# EAGLE design single_varactor (EAGLE 9.3.0)
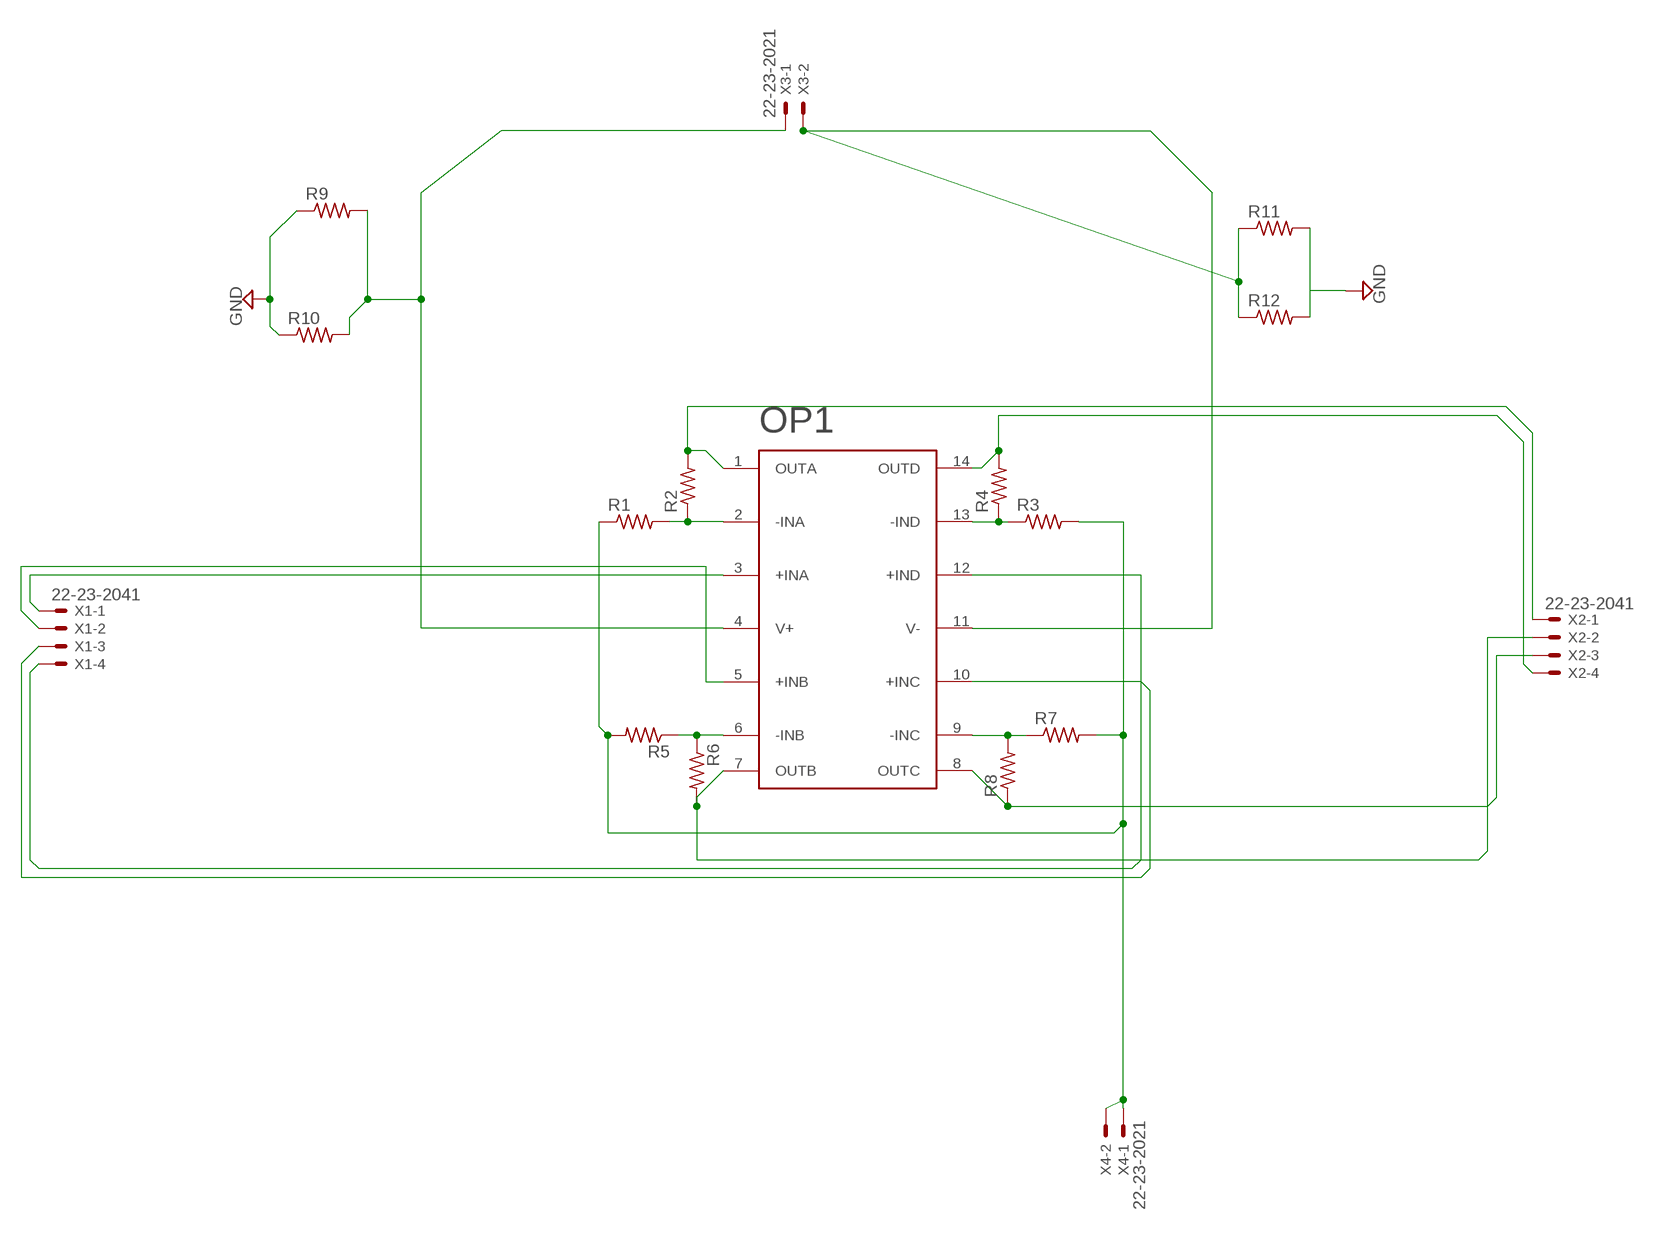
[diagram p0: schematic, sheet 1]

## Parts
OP1  OPAX4172  [OPAX172]
R1  R-US_0204/2V  [0204V]
R2  R-US_0204/2V  [0204V]
R3  R-US_0204/2V  [0204V]
R4  R-US_0204/2V  [0204V]
R5  R-US_0204/2V  [0204V]
R6  R-US_0204/2V  [0204V]
R7  R-US_0204/2V  [0204V]
R8  R-US_0204/2V  [0204V]
R9  R-US_0204/2V  [0204V]
R10  R-US_0204/2V  [0204V]
R11  R-US_0204/2V  [0204V]
R12  R-US_0204/2V  [0204V]
X1  22-23-2041  [22-23-2041]
X2  22-23-2041  [22-23-2041]
X3  22-23-2021  [22-23-2021]
X4  22-23-2021  [22-23-2021]

## Nets
GND: R9.1 R10.1
N$1: OP1.2(-INA) R1.2 R2.1
N$2: OP1.13(-IND) R3.1 R4.1
N$3: OP1.6(-INB) R5.1 R6.1
N$4: OP1.9(-INC) R7.1 R8.2
N$5: OP1.14(OUTD) R4.2 X2.4
N$6: OP1.1(OUTA) R2.2 X2.1
N$7: OP1.7(OUTB) R6.2 X2.2
N$8: OP1.8(OUTC) R8.1 X2.3
N$9: OP1.4(V+) R9.2 R10.2 X3.1
N$11: OP1.3(+INA) X1.1
N$12: OP1.5(+INB) X1.2
N$13: OP1.10(+INC) X1.3
N$14: OP1.12(+IND) X1.4
N$15: R11.2 R12.2
N$16: R1.1 R3.2 R5.2 R7.2 X4.1 X4.2
N$17: OP1.11(V-) R11.1 R12.1 X3.2

## Library data of the parts
OP1 = OPA4172IDR:OPAX4172: Created by Caleb Carr for the Advanced Radar Research Center, Norman, OK This is a replication of the TI OPAx4172 operational amplifier (+4.5-+36v)
R1-R12 = rcl:R-US_: RESISTOR, American symbol; SPICEPREFIX: R
X1 X2 = con-molex:22-23-2041: .100" (2.54mm) Center Header - 4 Pin; MF: MOLEX; MPN: 22-23-2041; OC_FARNELL: 1462920; OC_NEWARK: 38C0355
X3 X4 = con-molex:22-23-2021: .100" (2.54mm) Center Header - 2 Pin; MF: MOLEX; MPN: 22-23-2021; OC_FARNELL: 1462926; OC_NEWARK: 25C3832

## Board
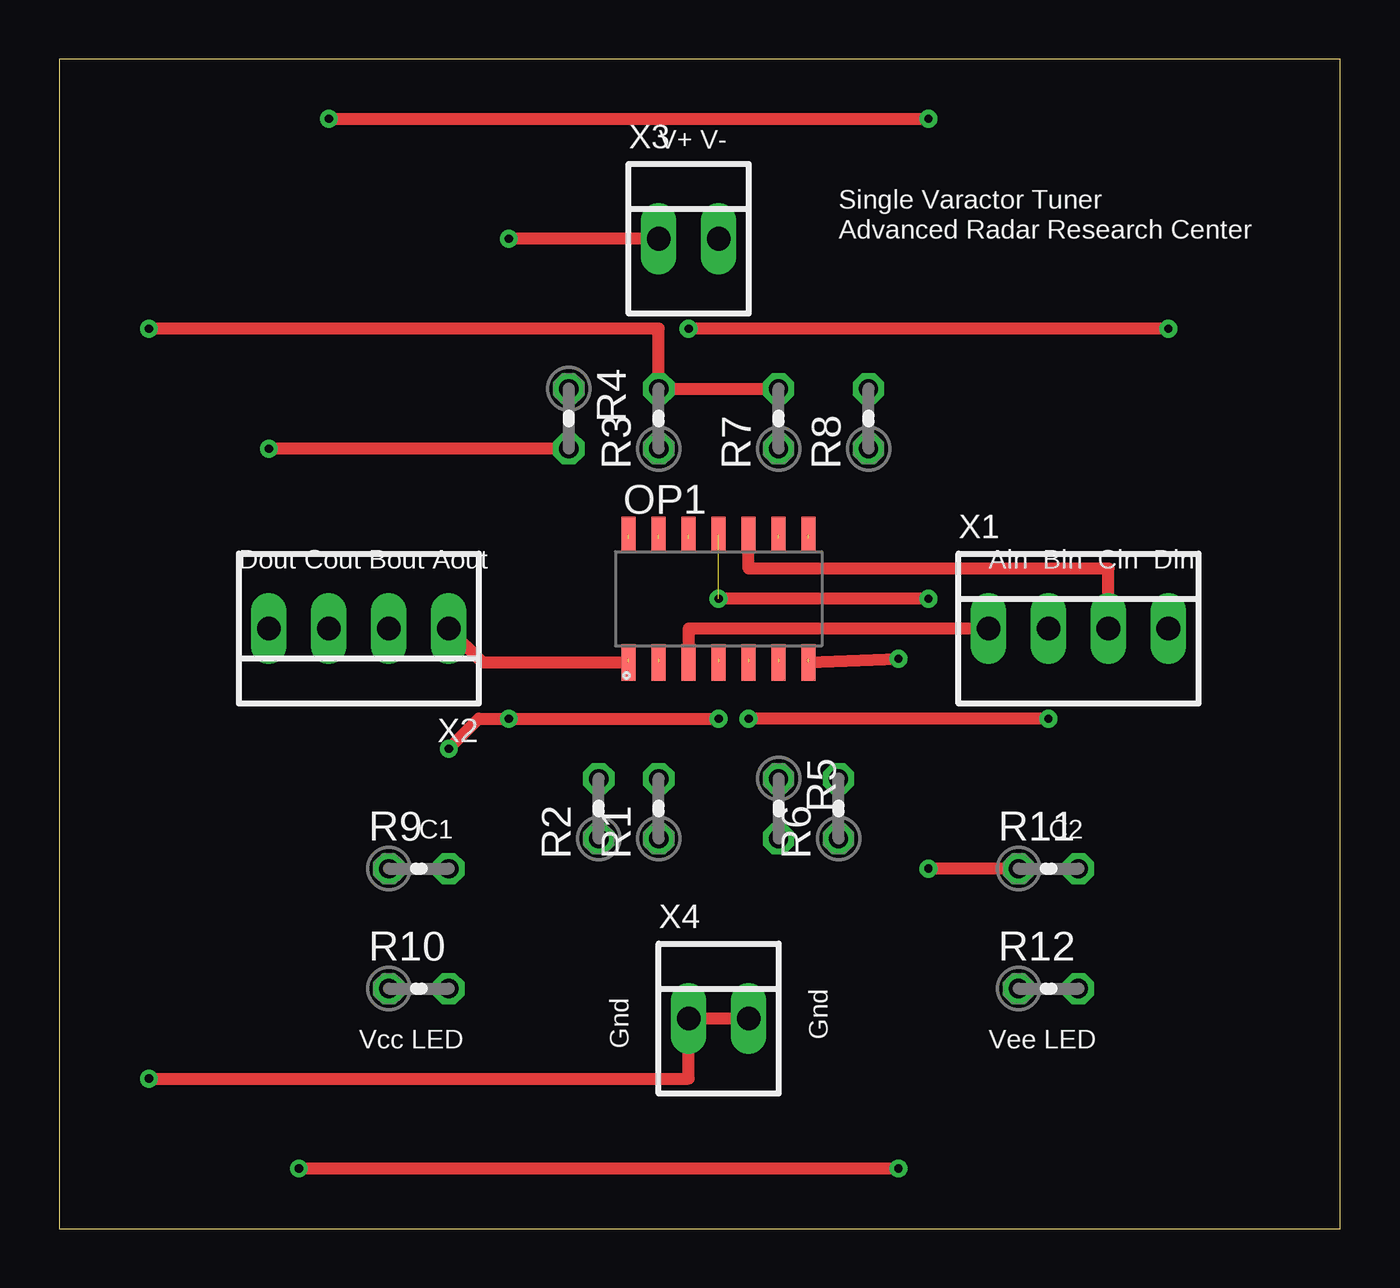
[diagram p1: board, top side]
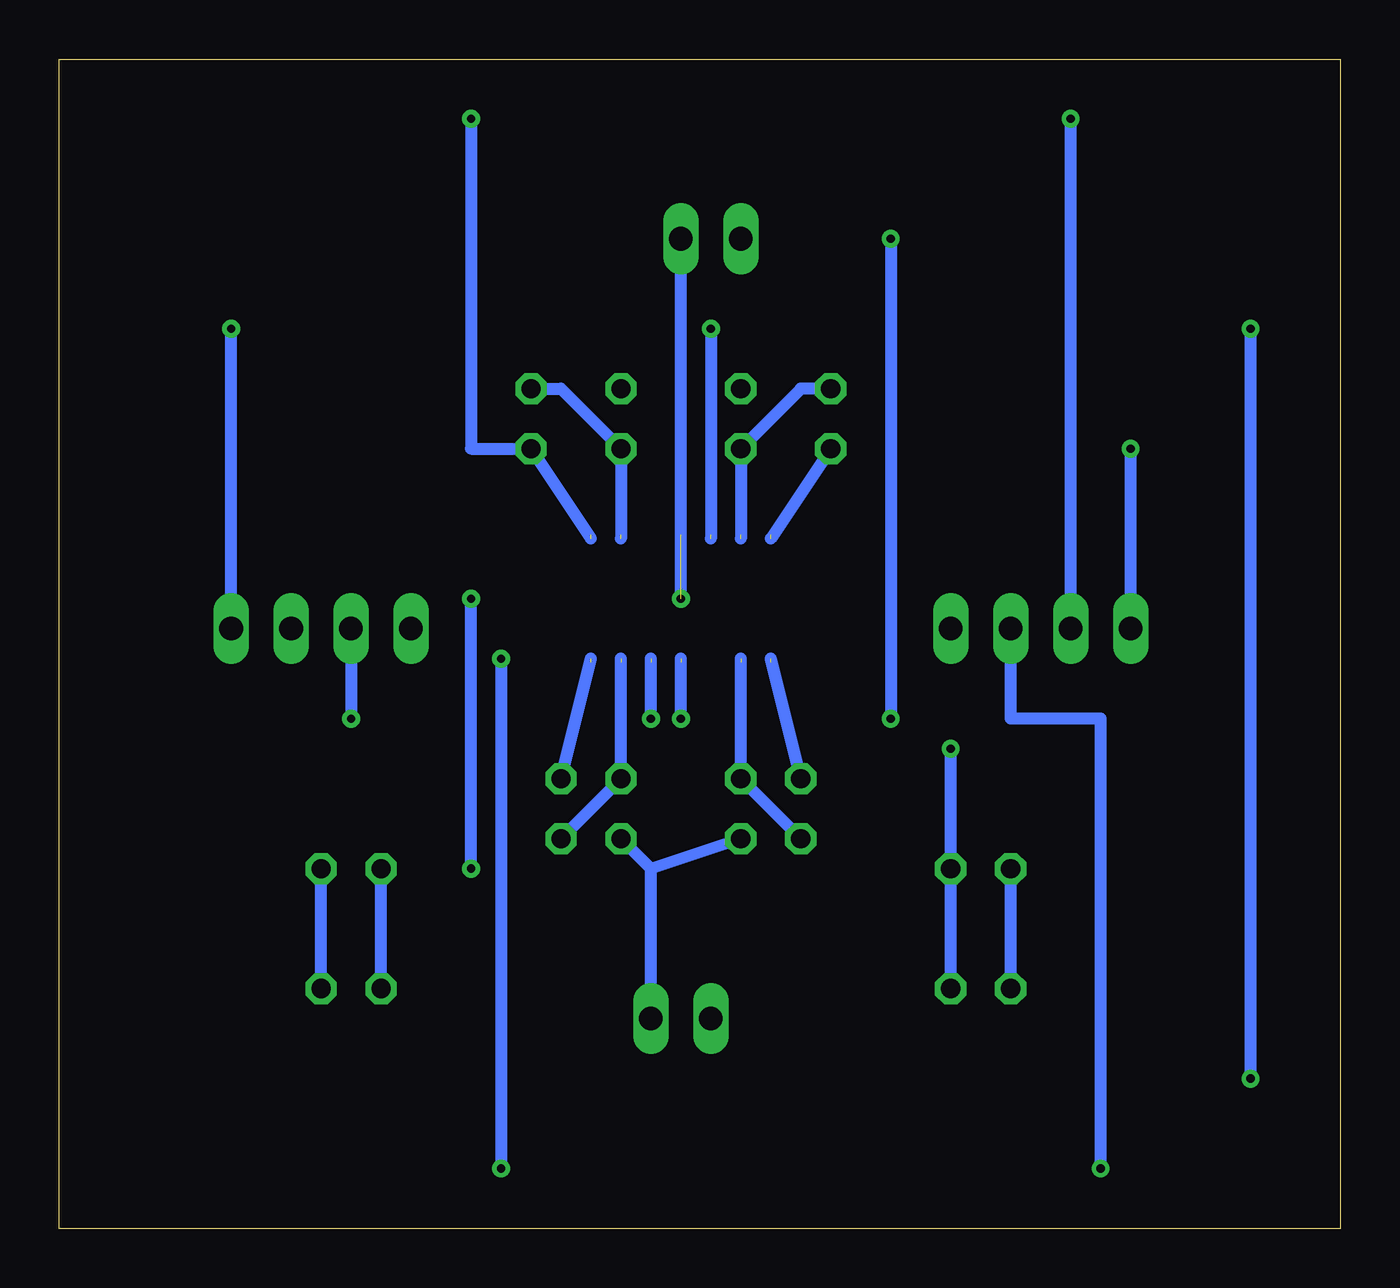
[diagram p2: board, bottom side, seen from below]

Size 54.28 x 49.52 mm. Coordinates in mm from the lower left corner, seen from the top.
Outline: 0,0 54.28,0 54.28,49.52 0,49.52 0,0
Copper layers (1*16): Top 0.035mm / dielectric 1.5mm / Bottom 0.035mm
Design rules "default": minimum track width 6mil, minimum drill 0.35mm, track to track 6mil, track to pad 6mil, pad to pad 6mil, via to via 6mil, smd to smd 6mil, copper to edge 40mil, drill to drill 6mil, minimum pad ring 10mil, minimum via ring 8mil, stop-mask expansion 4mil, vias tented up to drill 0mil, thermal gap 10mil

### Footprints (pad centres in the part's own frame; a part is rotated, then mirrored left to right if it is on the bottom)
OPAX172 = smd 0.6 x 1.55: 1 -3.81,-2.7; 2 -2.54,-2.7; 3 -1.27,-2.7; 4 0,-2.7; 5 1.27,-2.7; 6 2.54,-2.7; 7 3.81,-2.7; 8 3.81,2.7; 9 2.54,2.7; 10 1.27,2.7; 11 0,2.7; 12 -1.27,2.7; 13 -2.54,2.7; 14 -3.81,2.7
0204V = drill 0.813 octagon: 1 -1.27,0; 2 1.27,0
22-23-2041 = drill 1 long: 1 -3.81,0; 2 -1.27,0; 3 1.27,0; 4 3.81,0
22-23-2021 = drill 1 long: 1 -1.27,0; 2 1.27,0

### Placement (x,y rotation side)
OP1  27.94,26.67 0 top
R1  25.4,17.78 90 top
R2  22.86,17.78 90 top
R3  25.4,34.29 90 top
R4  21.59,34.29 270 top
R5  30.48,17.78 270 top
R6  33.02,17.78 90 top
R7  30.48,34.29 90 top
R8  34.29,34.29 90 top
R9  15.24,15.24 0 top
R10  15.24,10.16 0 top
R11  41.91,15.24 0 top
R12  41.91,10.16 0 top
X1  43.18,25.4 0 top
X2  12.7,25.4 180 top
X3  26.67,41.91 0 top
X4  27.94,8.89 0 top

### Tracks (layer width: path | path; a pad name or v marks a point on that pad's centre or on a via)
GND
  Bottom 0.508: R10.1 R9.1
N$1  (1 unrouted)
  Bottom 0.508: R2.1 R1.2 25.4,24.13
N$2  (1 unrouted)
  Bottom 0.508: 25.4,29.21 R3.1 22.86,35.56 R4.1
N$3  (1 unrouted)
  Bottom 0.508: 30.48,24.13 R5.1 R6.1
N$4  (1 unrouted)
  Top 0.152: R8.2 34.29,34.82
  Bottom 0.508: R8.2 33.02,35.56 R7.1 30.48,29.21
N$5  (via drill 0.35)  (1 unrouted)
  Top 0.508: R4.2 v8.89,33.02
  Bottom 0.508: X2.4 v8.89,33.02 | R4.2 24.13,29.21
N$6  (1 unrouted)
  Top 0.508: X2.1 17.94,23.97 OP1.1
  Bottom 0.508: R2.2 24.13,24.13
N$7  (via drill 0.35)  (1 unrouted)
  Top 0.508: OP1.7 v35.56,24.13 | v35.56,2.54 v10.16,2.54
  Bottom 0.508: R6.2 31.75,24.13 | v35.56,24.13 v35.56,2.54 | v10.16,2.54 10.16,21.59 13.97,21.59 X2.2
N$8  (via drill 0.35)  (1 unrouted)
  Top 0.508: v11.43,46.99 v36.83,46.99
  Bottom 0.508: 31.75,29.21 R8.1 36.83,33.02 v36.83,46.99 | X2.3 v11.43,46.99
N$9  (via drill 0.35)  (1 unrouted)
  Top 0.508: v16.51,20.32 17.78,21.59 v19.05,21.59 v27.94,21.59 | X3.1 v19.05,41.91
  Bottom 0.508: R10.2 R9.2 v16.51,20.32 | v27.94,21.59 27.94,24.13 | v19.05,41.91 v19.05,21.59
N$11
  Top 0.508: X1.1 26.67,25.4 OP1.3
N$12  (via drill 0.35)  (1 unrouted)
  Top 0.508: v41.91,21.59 v29.21,21.59
  Bottom 0.508: X1.2 v41.91,21.59 | v29.21,21.59 29.21,24.13
N$13
  Top 0.508: X1.3 44.45,27.94 29.21,27.94 OP1.10
N$14  (via drill 0.35)  (1 unrouted)
  Top 0.508: v46.99,38.1 v26.67,38.1
  Bottom 0.508: X1.4 v46.99,38.1 | v26.67,38.1 26.67,29.21
N$15
  Bottom 0.508: R12.2 R11.2
N$16  (via drill 0.35)
  Top 0.508: X4.2 X4.1 26.67,6.35 v3.81,6.35 | R7.2 R3.2 25.4,38.1 v3.81,38.1
  Bottom 0.508: X4.2 29.21,15.24 | 29.21,15.24 R5.2 | R1.1 29.21,15.24 | v3.81,38.1 v3.81,6.35
N$17  (via drill 0.35)  (1 unrouted)
  Top 0.508: R11.1 v36.83,15.24 | v36.83,26.67 v27.94,26.67
  Bottom 0.508: R12.1 R11.1 | v36.83,15.24 v36.83,26.67 | v27.94,26.67 X3.2

### Text on the board
tNames: V+ V- | Single Varactor Tuner | Advanced Radar Research Center | Dout Cout Bout Aout | Ain Bin Cin Din | C1 | C2 | Gnd | Vcc LED | Gnd | Vee LED